# EAGLE design Pletacka_board (EAGLE 9.6.0)

## Sheet 1 of 3: ESP32 + UI
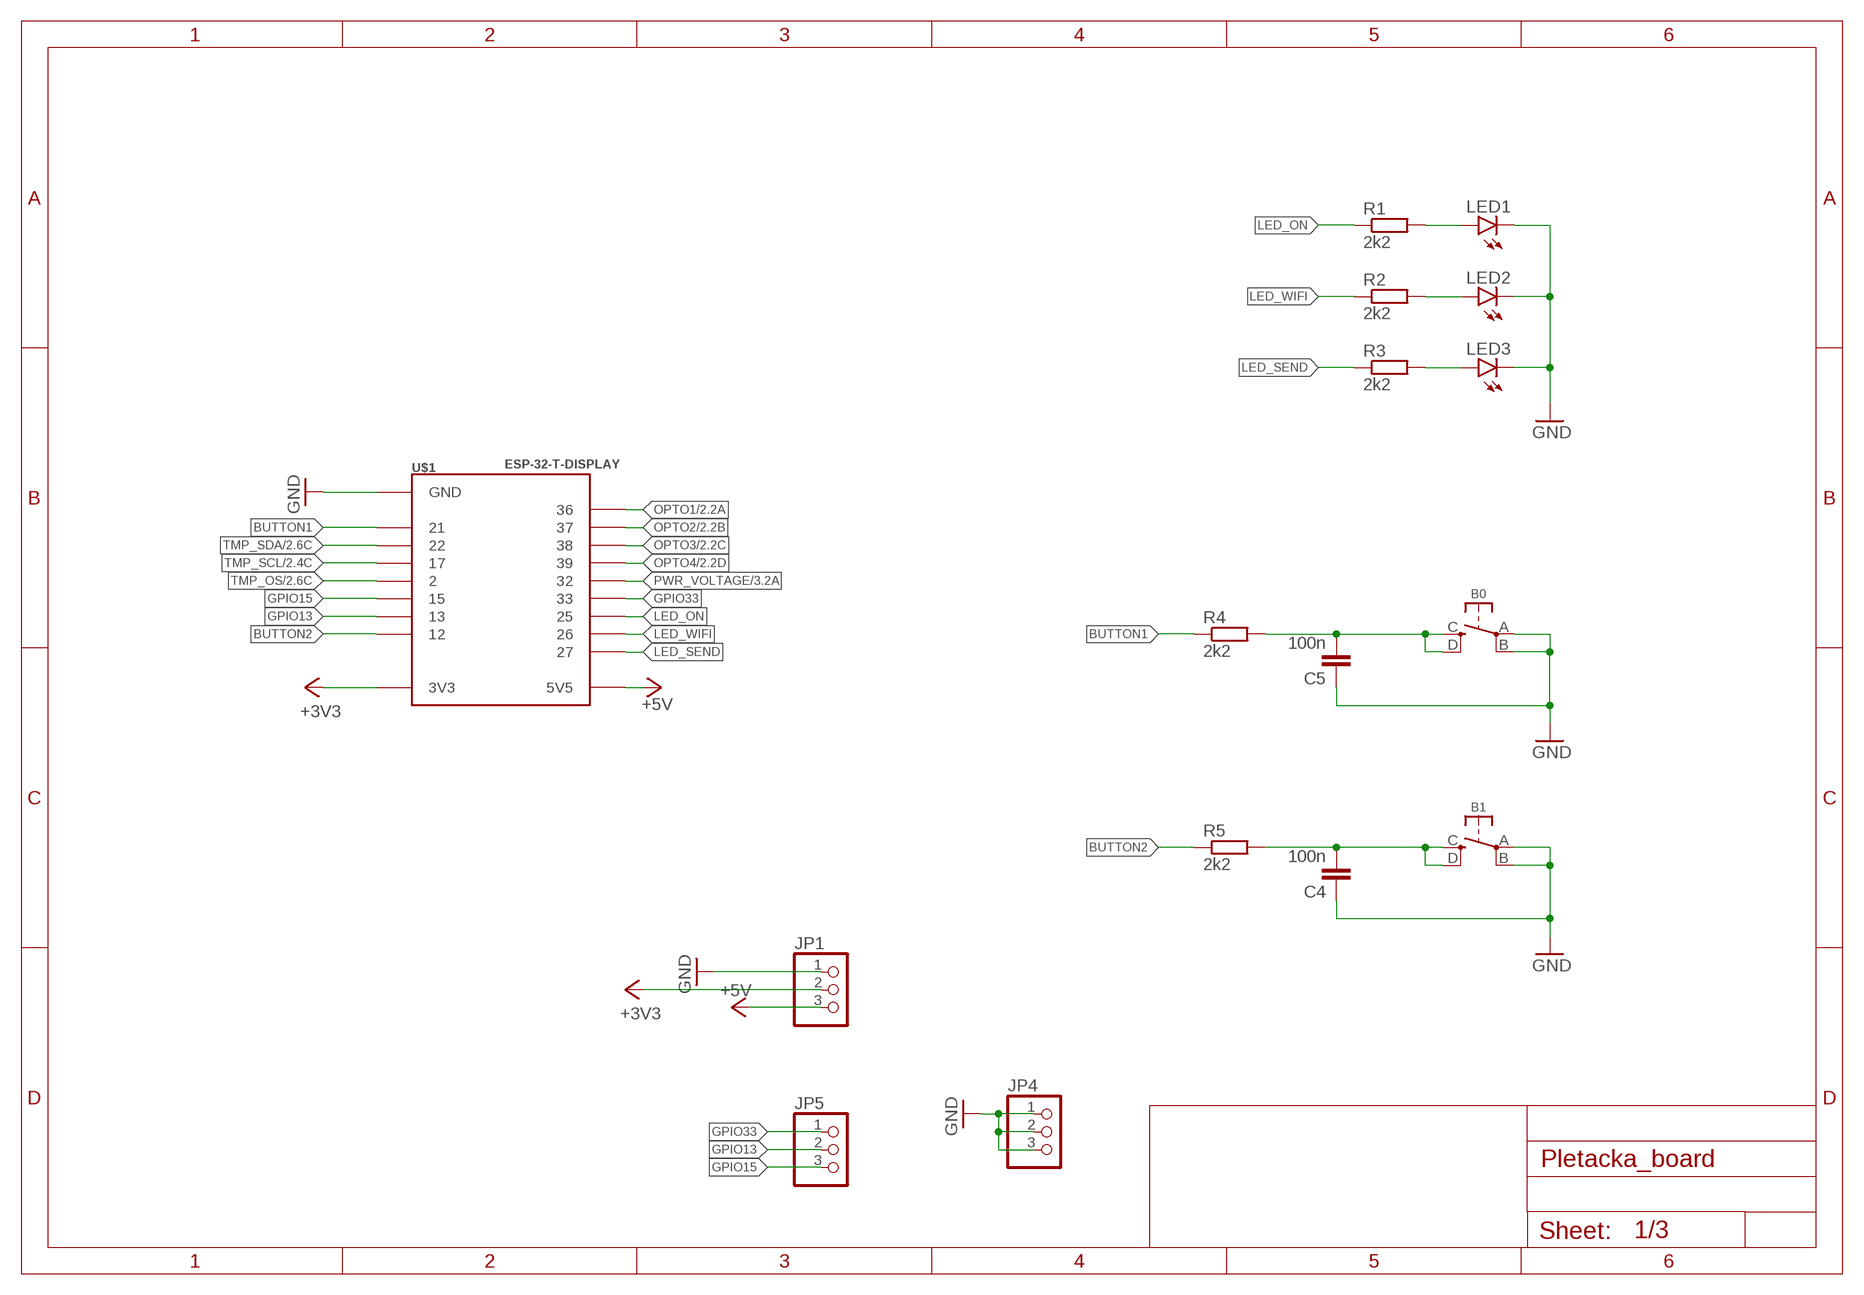
[diagram p0: schematic, sheet 1]

### Parts
B0  ENTER  10-XX_SMD  [TS-1187A]
B1  B1  10-XX_SMD  [TS-1187A]
C4  100n  C-EUC0603  [C0603]
C5  100n  C-EUC0603  [C0603]
JP1  PINHD-1X3  [1X03]
JP4  PINHD-1X3  [1X03]
JP5  PINHD-1X3  [1X03]
LED1  LEDCHIPLED_0603  [CHIPLED_0603]
LED2  LEDCHIPLED_0603  [CHIPLED_0603]
LED3  LEDCHIPLED_0603  [CHIPLED_0603]
R1  2k2  R-EU_R0603  [R0603]
R2  2k2  R-EU_R0603  [R0603]
R3  2k2  R-EU_R0603  [R0603]
R4  2k2  R-EU_R0603  [R0603]
R5  2k2  R-EU_R0603  [R0603]
U$1  ESP-32-T-DISPLAY  [ESP32-T-DISPLAY]

### Nets
+3V3: JP1.2 U$1.3V3 U$1.3V3-2(3V3) ; also sheet 2
+5V: JP1.3 U$1.5V(5V5) ; also sheet 3
BUTTON1: R4.1 U$1.21
BUTTON2: R5.1 U$1.12
GND: B0.A(P) B0.B(P1) B1.A(P) B1.B(P1) C4.1 C5.1 JP1.1 JP4.1 JP4.2 JP4.3 LED1.C LED2.C LED3.C U$1.G-1(GND) U$1.G-2(GND) U$1.G-3(GND) U$1.G-4(GND) U$1.G-5(GND) ; also sheet 2,3
GPIO13: JP5.2 U$1.13
GPIO15: JP5.3 U$1.15
GPIO33: JP5.1 U$1.33
LED_ON: R1.1 U$1.25
LED_SEND: R3.1 U$1.27
LED_WIFI: R2.1 U$1.26
N$1: LED1.A R1.2
N$2: LED2.A R2.2
N$8: B0.C(S) B0.D(S1) C5.2 R4.2
N$10: B1.C(S) B1.D(S1) C4.2 R5.2
N$12: LED3.A R3.2
OPTO1: U$1.36 ; also sheet 2
OPTO2: U$1.37 ; also sheet 2
OPTO3: U$1.38 ; also sheet 2
OPTO4: U$1.39 ; also sheet 2
PWR_VOLTAGE: U$1.32 ; also sheet 3
TMP_OS: U$1.2 ; also sheet 2
TMP_SCL: U$1.17 ; also sheet 2
TMP_SDA: U$1.22 ; also sheet 2

## Sheet 2 of 3: Sensors
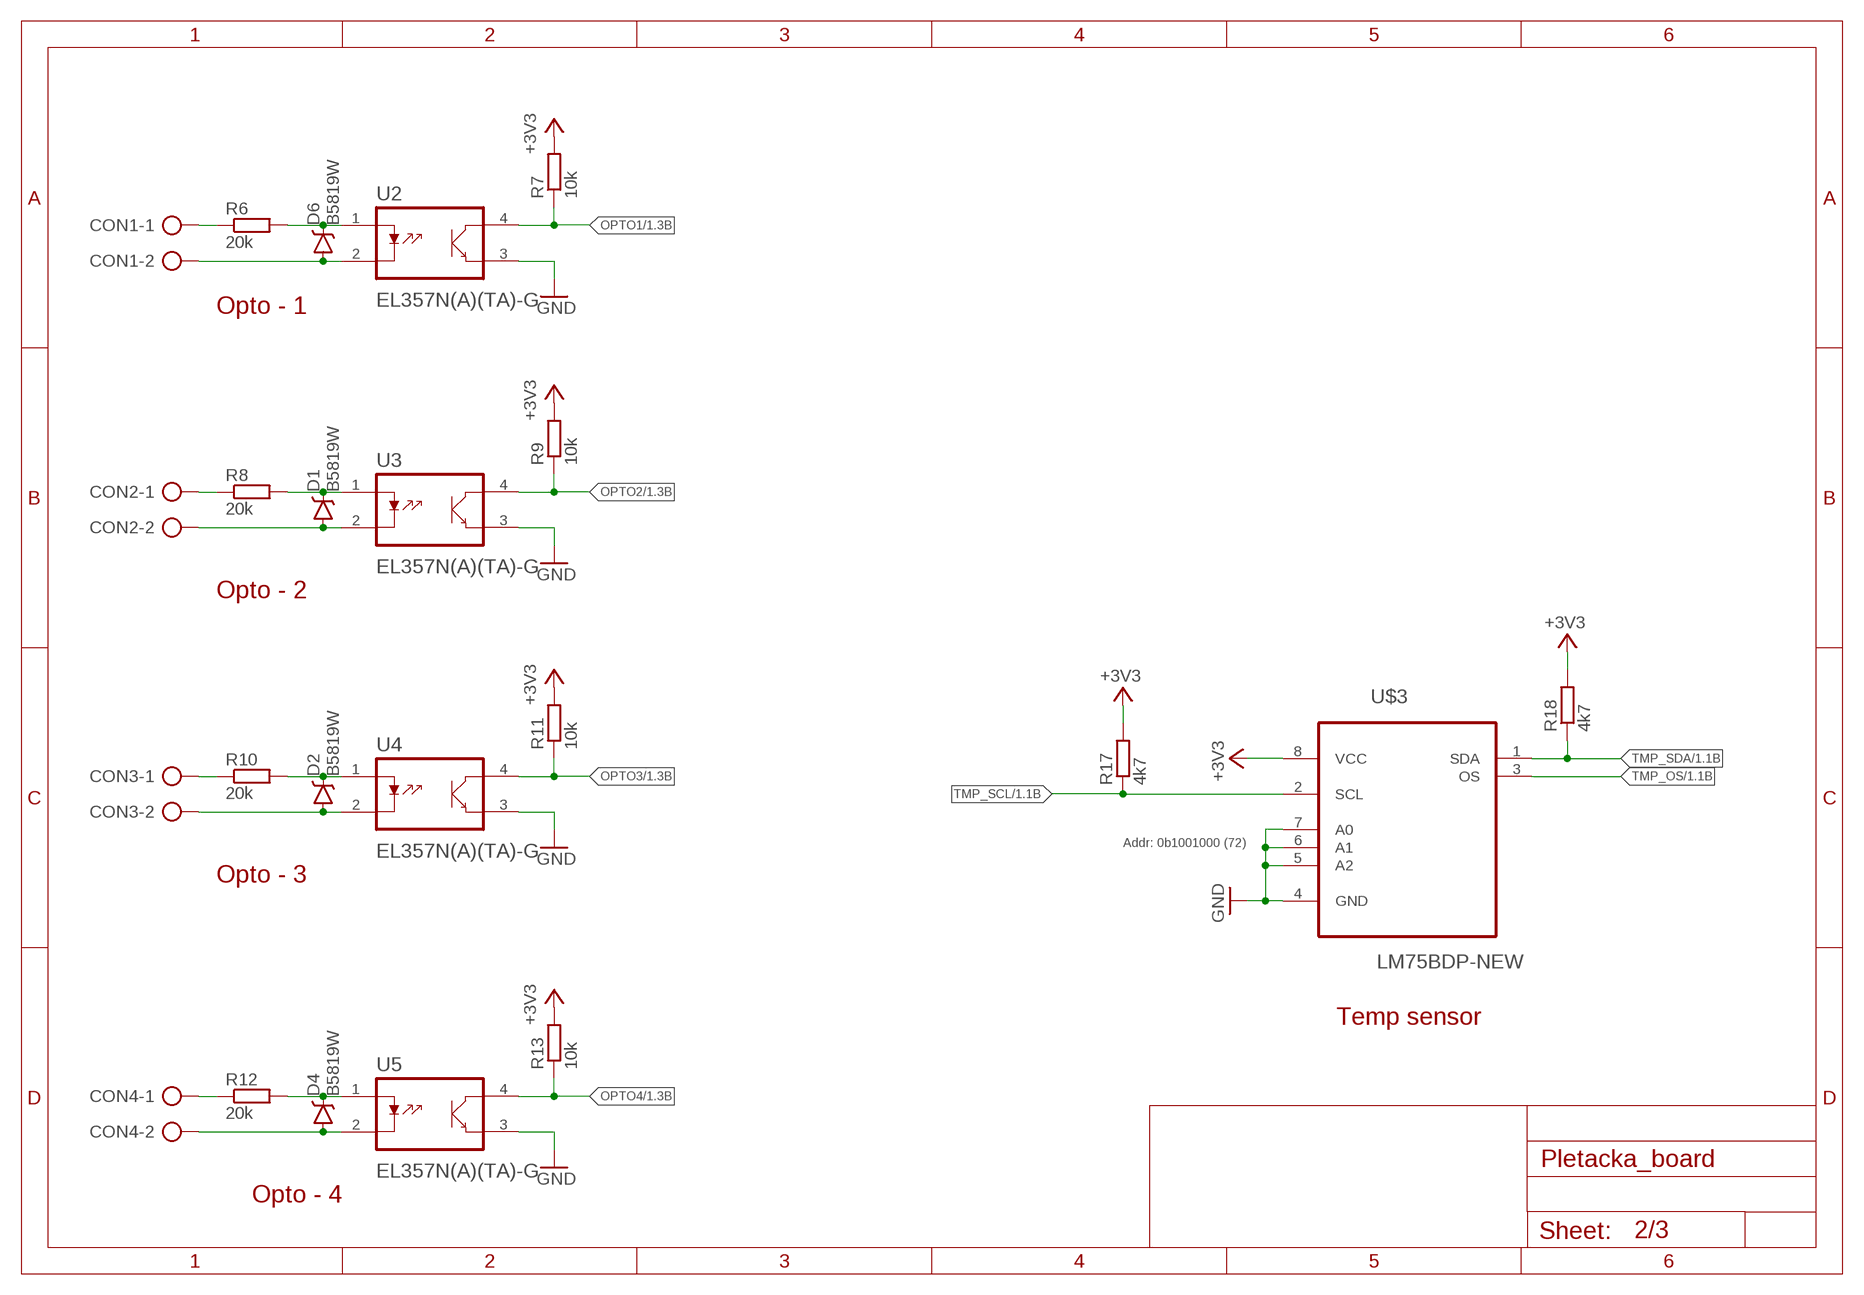
[diagram p1: schematic, sheet 2]

### Parts
CON1  AK500/2  [AK500/2]
CON2  AK500/2  [AK500/2]
CON3  AK500/2  [AK500/2]
CON4  AK500/2  [AK500/2]
D1  B5819W  [SOD-123]
D2  B5819W  [SOD-123]
D4  B5819W  [SOD-123]
D6  B5819W  [SOD-123]
R6  20k  R-EU_R0603  [R0603]
R7  10k  R-EU_R0603  [R0603]
R8  20k  R-EU_R0603  [R0603]
R9  10k  R-EU_R0603  [R0603]
R10  20k  R-EU_R0603  [R0603]
R11  10k  R-EU_R0603  [R0603]
R12  20k  R-EU_R0603  [R0603]
R13  10k  R-EU_R0603  [R0603]
R17  4k7  R-EU_R0603  [R0603]
R18  4k7  R-EU_R0603  [R0603]
U2  EL357N(A)(TA)-G  [SOP254P700X200-4N]
U3  EL357N(A)(TA)-G  [SOP254P700X200-4N]
U4  EL357N(A)(TA)-G  [SOP254P700X200-4N]
U5  EL357N(A)(TA)-G  [SOP254P700X200-4N]
U$3  LM75BDP-NEW  [SOT505-1]

### Nets
+3V3: R7.2 R9.2 R11.2 R13.2 R17.2 R18.2 U$3.8(VCC) ; also sheet 1
GND: U2.3(E) U3.3(E) U4.3(E) U5.3(E) U$3.4(GND) U$3.5(A2) U$3.6(A1) U$3.7(A0) ; also sheet 1,3
N$6: CON1.1 R6.1
N$7: CON1.2 D6.A U2.2(K)
N$9: D6.C R6.2 U2.1(A)
N$13: CON2.1 R8.1
N$14: CON2.2 D1.A U3.2(K)
N$15: D1.C R8.2 U3.1(A)
N$16: CON3.1 R10.1
N$17: CON3.2 D2.A U4.2(K)
N$18: D2.C R10.2 U4.1(A)
N$19: CON4.1 R12.1
N$20: CON4.2 D4.A U5.2(K)
N$21: D4.C R12.2 U5.1(A)
OPTO1: R7.1 U2.4(C) ; also sheet 1
OPTO2: R9.1 U3.4(C) ; also sheet 1
OPTO3: R11.1 U4.4(C) ; also sheet 1
OPTO4: R13.1 U5.4(C) ; also sheet 1
TMP_OS: U$3.3(OS) ; also sheet 1
TMP_SCL: R17.1 U$3.2(SCL) ; also sheet 1
TMP_SDA: R18.1 U$3.1(SDA) ; also sheet 1

### Notes on the sheet
- Opto - 1
- Opto - 2
- Addr: 0b1001000 (72)
- Opto - 3
- Temp sensor
- Opto - 4

## Sheet 3 of 3: Power
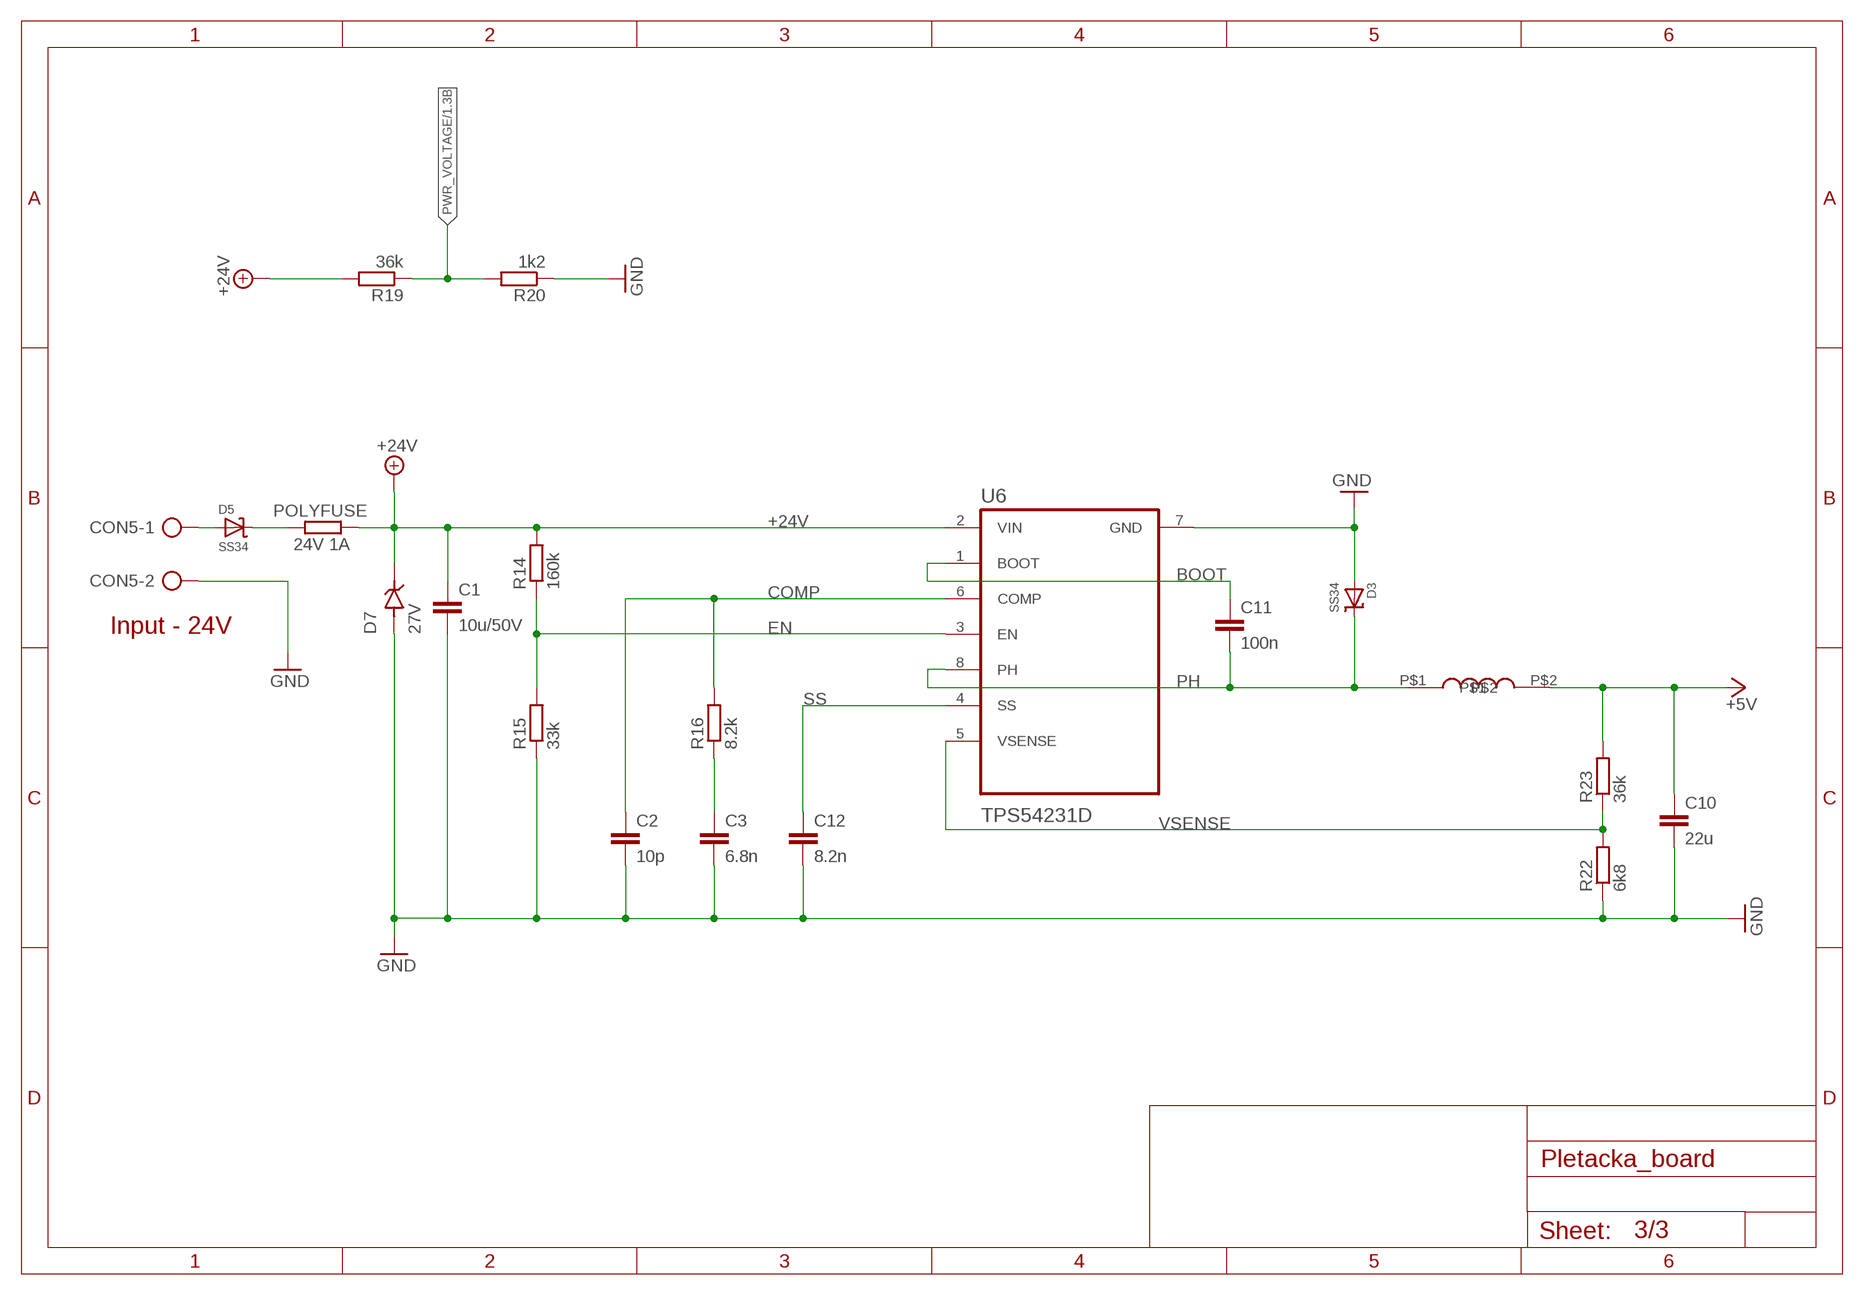
[diagram p2: schematic, sheet 3]

### Parts
C1  10u/50V  C-EUC1206  [C1206]
C2  10p  C-EUC0603  [C0603]
C3  6.8n  C-EUC0603  [C0603]
C10  22u  C-EUC0805  [C0805]
C11  100n  C-EUC0603  [C0603]
C12  8.2n  C-EUC0603  [C0603]
CON5  AK500/2  [AK500/2]
D3  SS34  SHOTTKY-SMA  [SMA]
D5  SS34  SHOTTKY-SMA  [SMA]
D7  27V  1SMB5935BT3G  [DIOM5436X247N]
POLYFUSE  24V 1A  R-EU_R1206  [R1206]
R14  160k  R-EU_R0603  [R0603]
R15  33k  R-EU_R0603  [R0603]
R16  8.2k  R-EU_R0603  [R0603]
R19  36k  R-EU_R0603  [R0603]
R20  1k2  R-EU_R0603  [R0603]
R22  6k8  R-EU_R0603  [R0603]
R23  36k  R-EU_R0603  [R0603]
U6  TPS54231D  [SOIC127P599X175-8N]
U$2  SWRB1204S  [SWRB1204S]

### Nets
+5V: C10.1 R23.2 U$2.P$2 ; also sheet 1
+24V: C1.1 D7.C(K) POLYFUSE.1 R14.2 R19.2 U6.2(VIN)
BOOT: C11.1 U6.1(BOOT)
COMP: C2.1 R16.2 U6.6(COMP)
EN: R14.1 R15.2 U6.3(EN)
GND: C1.2 C2.2 C3.2 C10.2 C12.2 CON5.2 D3.A D7.A R15.1 R20.1 R22.1 U6.7(GND) ; also sheet 1,2
N$3: CON5.1 D5.A
N$4: D5.C POLYFUSE.2
N$25: C3.1 R16.1
PH: C11.2 D3.C U6.8(PH) U$2.P$1
PWR_VOLTAGE: R19.1 R20.2 ; also sheet 1
SS: C12.1 U6.4(SS)
VSENSE: R22.2 R23.1 U6.5(VSENSE)

### Notes on the sheet
- Input - 24V

## Library data of the parts
B0 B1 = switch-omron:10-XX: OMRON SWITCH; LCSC_ID: C318888
C1 = rcl_upravena:C-EU: CAPACITOR, European symbol; LCSC_ID: C13585
C2 = rcl_upravena:C-EU: CAPACITOR, European symbol; LCSC_ID: C1634
C3 = rcl_upravena:C-EU: CAPACITOR, European symbol; LCSC_ID: C1631
C4 C5 C11 = rcl_upravena:C-EU: CAPACITOR, European symbol; LCSC_ID: C14663
C10 = rcl_upravena:C-EU: CAPACITOR, European symbol; LCSC_ID: C45783
C12 = rcl_upravena:C-EU: CAPACITOR, European symbol; LCSC_ID: C27920
CON1-CON5 = #Svorkovnice:AK500/2: CONNECTOR
D1 D2 D4 D6 = B5819W:B5819W: Diodo Schottky 40V 1A Basic part Buy Part <https://snapeda.com/parts/B5819W/Taiwan%20Semiconductor/view-part/?ref=eda>; AVAILABILITY: Warning; DESCRIPTION: B5819W; LCSC_ID: C8598; MF: Taiwan Semiconductor; MP: B5819W; PACKAGE: SOD-123 Taiwan Semiconductor; PRICE: None
D3 D5 = diode:SHOTTKY; LCSC_ID: C8678
D7 = 1SMB5935BT3G:1SMB5935BT3G: Zener Diode 5.6V 3W ±5% Surface Mount SMB Buy Part <https://snapeda.com/parts/1SMB5935BT3G/ON%20Semiconductor/view-part/?ref=eda>; ARROW_ELECTRONICS-PURCHASE-URL: https://snapeda.com/shop?store=Arrow+Electronics&id=285964; AVAILABILITY: Good; DESCRIPTION: Zener Diode 27V 550mW ±5% Surface Mount SMB; DIGIKEY-PURCHASE-URL: https://snapeda.com/shop?store=DigiKey&id=285964; LCSC_ID: C49827; MF: ON Semiconductor; MOUSER-PURCHASE-URL: https://snapeda.com/shop?store=Mouser&id=285964; MP: 1SMB5935BT3G; PACKAGE: DO-214 ON Semiconductor; PRICE: None
JP1 JP4 JP5 = pinhead:PINHD-1X3: PIN HEADER
LED1-LED3 = led:LED: LED OSRAM: - CHIPLED LG R971, LG N971, LY N971, LG Q971, LY Q971, LO R971, LY R971 LH N974, LH R974 LS Q976, LO Q976, LY Q976 LO Q996 - Hyper CHIPLED LW Q18S LB Q993, LB Q99A, LB R99A - SideLED LS A670, LO A670, LY A670, LG A670, LP A670 LB A673, LV A673, LT A673, LW A673 LH A674 LY A675 LS A676, LA A676, LO A676, LY A676, LW A676 LS A679, LY A679, LG A679 - Hyper Micro SIDELED® LS Y876, LA Y876, LO Y876, LY Y876 LT Y87S - SmartLED LW L88C, LW L88S LB L89C, LB L89S, LG L890 LS L89K, LO L89K, LY L89K LS L896, LA L896, LO L896, LY L896 - TOPLED LS T670, LO T670, LY T670, LG T670, LP T670 LSG T670, LSP T670, LSY T670, LOP T670, LYG T670 LG T671, LOG T671, LSG T671 LB T673, LV T673, LT T673, LW T673 LH T674 LS T676, LA T676, LO T676, LY T676, LB T676, LH T676, LSB T676, LW T676 LB T67C, LV T67C, LT T67C, LS T67K, LO T67K, LY T67K, LW E67C LS E67B, LA E67B, LO E67B, LY E67B, LB E67C, LV E67C, LT E67C LW T67C LS T679, LY T679, LG T679 LS T770, LO T770, LY T770, LG T770, LP T770 LB T773, LV T773, LT T773, LW T773 LH T774 LS E675, LA E675, LY E675, LS T675 LS T776, LA T776, LO T776, LY T776, LB T776 LHGB T686 LT T68C, LB T68C - Hyper Mini TOPLED® LB M676 - Mini TOPLED Santana® LG M470 LS M47K, LO M47K, LY M47K Source: http://www.osram.convergy.de LUXEON: - LUMILED® LXK2-PW12-R00, LXK2-PW12-S00, LXK2-PW14-U00, LXK2-PW14-V00 LXK2-PM12-R00, LXK2-PM12-S00, LXK2-PM14-U00 LXK2-PE12-Q00, LXK2-PE12-R00, LXK2-PE12-S00, LXK2-PE14-T00, LXK2-PE14-U00 LXK2-PB12-K00, LXK2-PB12-L00, LXK2-PB12-M00, LXK2-PB14-N00, LXK2-PB14-P00, LXK2-PB14-Q00 LXK2-PR12-L00, LXK2-PR12-M00, LXK2-PR14-Q00, LXK2-PR14-R00 LXK2-PD12-Q00, LXK2-PD12-R00, LXK2-PD12-S00 LXK2-PH12-R00, LXK2-PH12-S00 LXK2-PL12-P00, LXK2-PL12-Q00, LXK2-PL12-R00 Source: www.luxeon.com KINGBRIGHT: KA-3528ASYC Source: www.kingbright.com; LCSC_ID: C2286
POLYFUSE = rcl_upravena:R-EU_: RESISTOR, European symbol; LCSC_ID: C70076; MFR_ID: nSMD050-24V
R1-R5 = rcl_upravena:R-EU_: RESISTOR, European symbol; LCSC_ID: C4190
R6 R8 R10 R12 = rcl_upravena:R-EU_: RESISTOR, European symbol; LCSC_ID: C4184
R7 R9 R11 R13 = rcl_upravena:R-EU_: RESISTOR, European symbol; LCSC_ID: C25804
R14 = rcl_upravena:R-EU_: RESISTOR, European symbol; LCSC_ID: C22813
R15 = rcl_upravena:R-EU_: RESISTOR, European symbol; LCSC_ID: C4216
R16 = rcl_upravena:R-EU_: RESISTOR, European symbol; LCSC_ID: C25981
R17 R18 = rcl_upravena:R-EU_: RESISTOR, European symbol; LCSC_ID: C23162
R19 R23 = rcl_upravena:R-EU_: RESISTOR, European symbol; LCSC_ID: C23147
R20 = rcl_upravena:R-EU_: RESISTOR, European symbol; LCSC_ID: C22765
R22 = rcl_upravena:R-EU_: RESISTOR, European symbol; LCSC_ID: C23212
U2-U5 = EL357N_A__TA_-G:EL357N(A)(TA)-G: Optocoupler [Everlight Electronics] EL357N(A)(TA)-G Optocoupler; AVAILABILITY: Unavailable; DESCRIPTION: Optoisolator Transistor Output 3750Vrms 1 Channel 4-SOP (2.54mm); LCSC_ID: C6649; MF: Everlight Electronics; MP: EL357N(A)(TA)-G; PACKAGE: SOP-4 Everlight; PRICE: None
U6 = TPS54231D:TPS54231D: Buy Part <https://snapeda.com/parts/TPS54231D/Texas%20Instruments/view-part/?ref=eda>; AVAILABILITY: Good; DESCRIPTION: 3.5 to 28V Input, 2A, 570kHz Step-Down Converter with Eco-mode&trade, 8-SOIC -40 to 150; DIGIKEY-PURCHASE-URL: https://snapeda.com/shop?store=DigiKey&id=456068; LCSC_ID: C28023; MF: Texas Instruments; MOUSER-PURCHASE-URL: https://snapeda.com/shop?store=Mouser&id=456068; MP: TPS54231D; PACKAGE: SOIC-8 Texas Instruments; PRICE: None; TEXAS_INSTRUMENTS-PURCHASE-URL: https://snapeda.com/shop?store=Texas+Instruments&id=456068
U$1 = ESP32-T-Display:ESP-32-T-DISPLAY
U$2 = SWRB1204S-680MT:SWRB1204S; LCSC_ID: C169399
U$3 = LM75BDP:LM75BDP-NEW; LCSC_ID: C33099

## Board
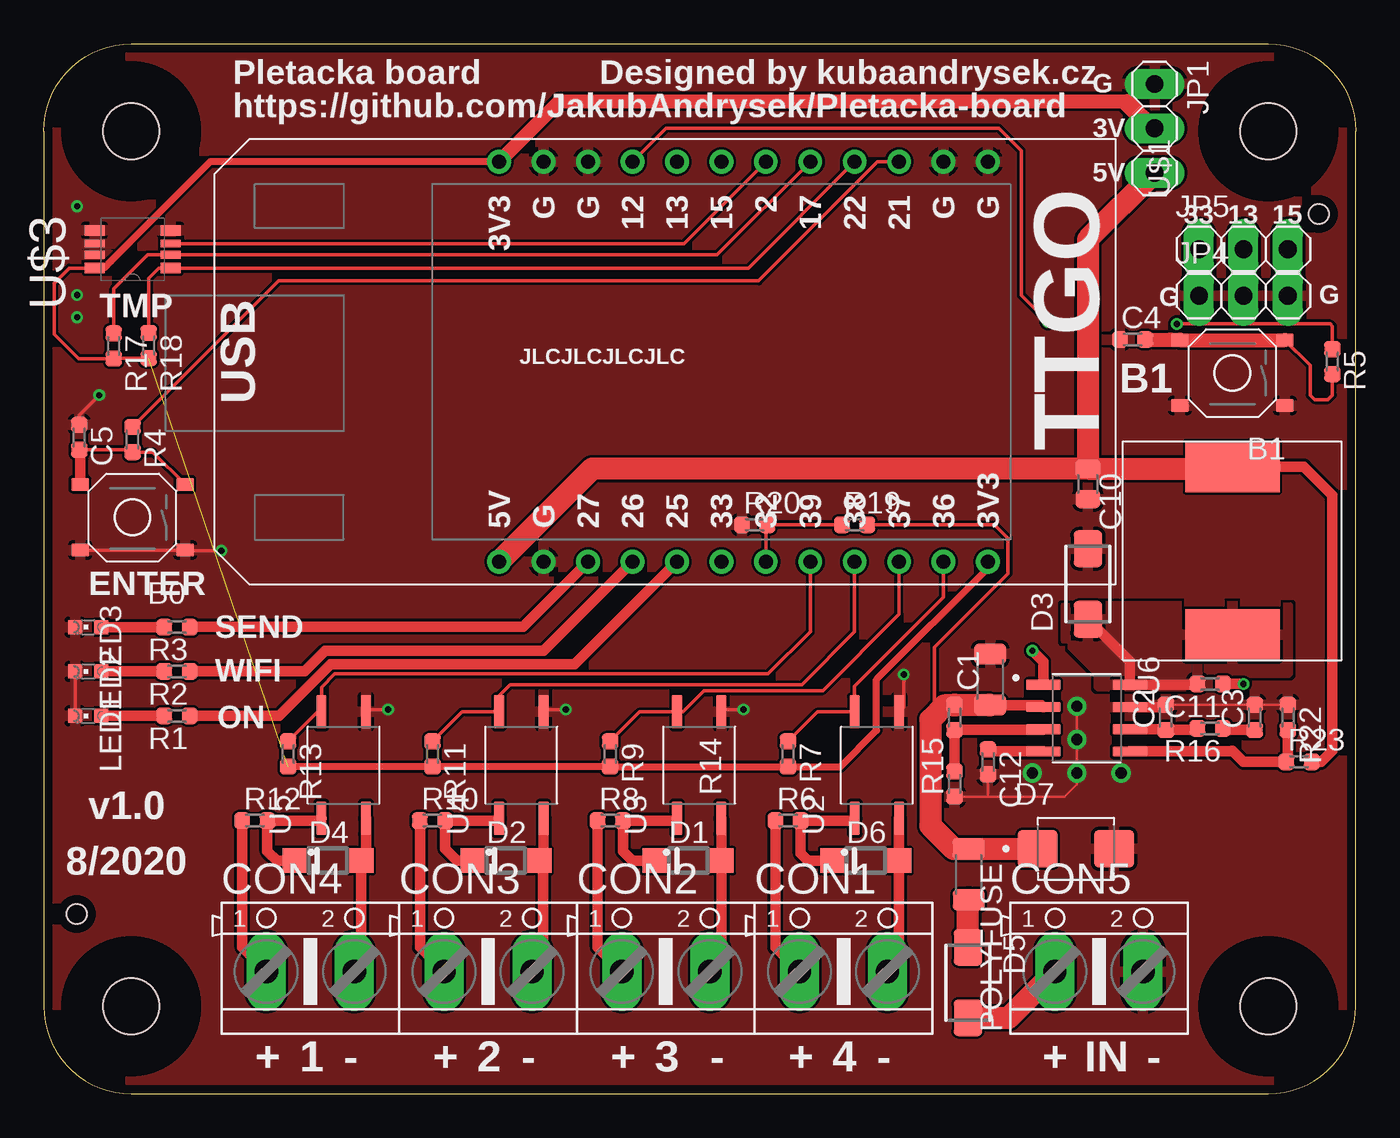
[diagram p3: board, top side]
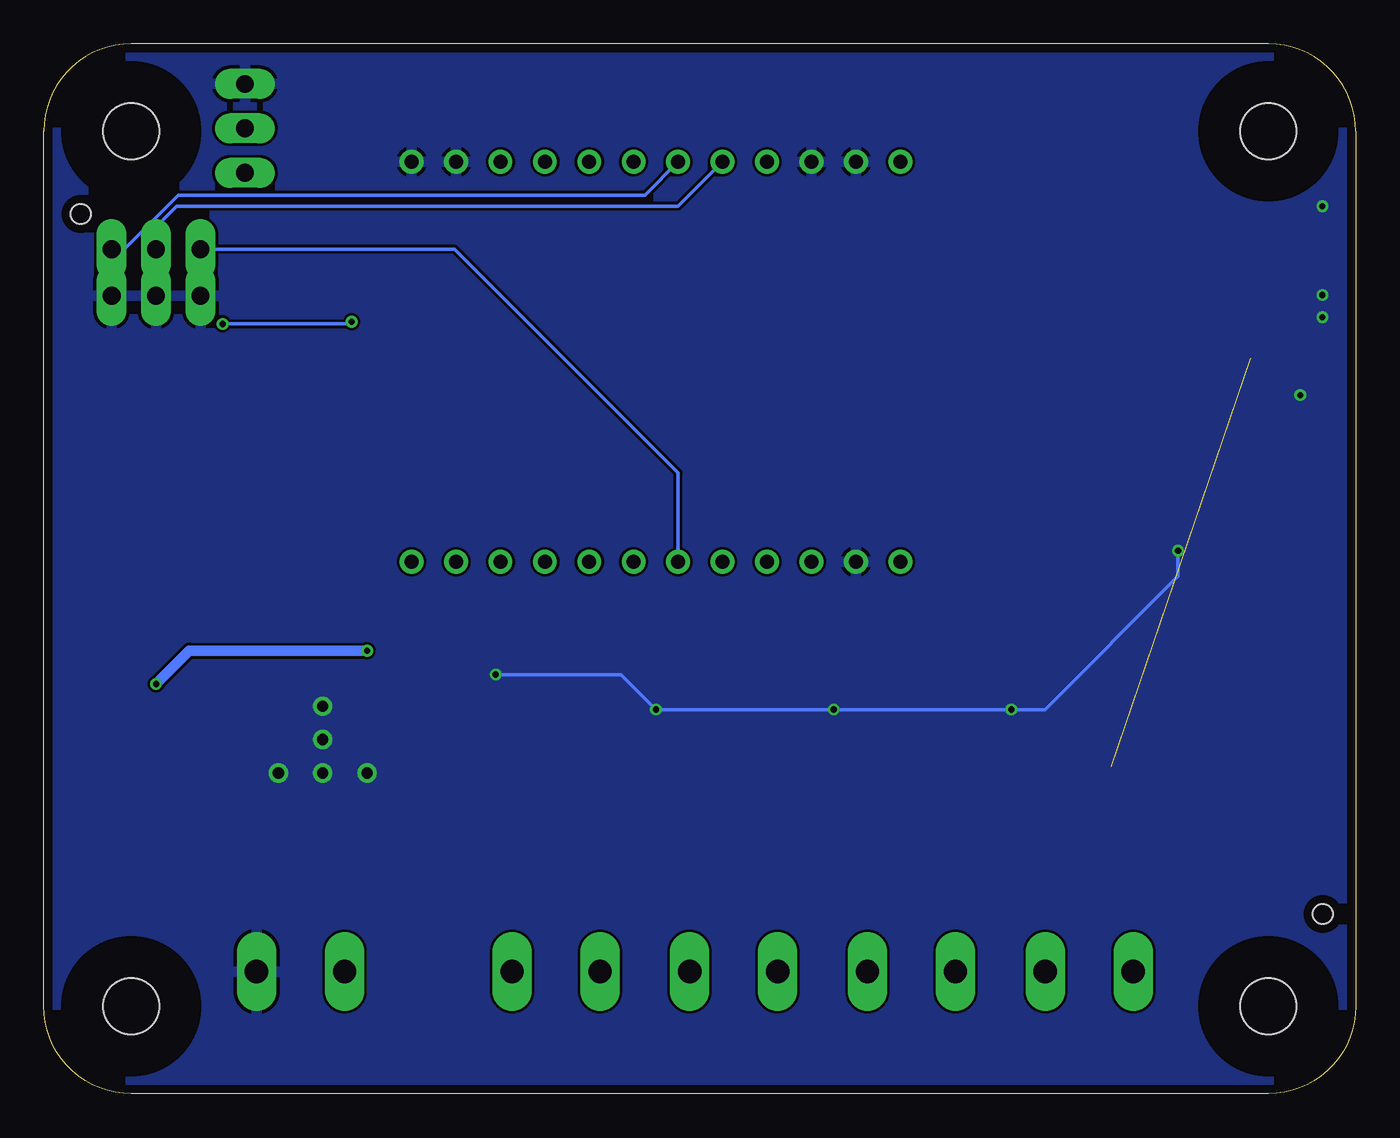
[diagram p4: board, bottom side, seen from below]

Size 75 x 60 mm. Coordinates in mm from the lower left corner, seen from the top.
Outline: 0,55 0,5 arc90 5,0 70,0 arc90 75,5 75,55 arc90 70,60 5,60 arc90 0,55
Copper layers (1*16): Top 0.035mm / dielectric 1.5mm / Bottom 0.035mm
Design rules "roboticsbrno": minimum track width 0.15mm, minimum drill 0.3mm, track to track 0.15mm, track to pad 0.15mm, pad to pad 0.15mm, via to via 0.15mm, smd to smd 0.15mm, copper to edge 0.5mm, drill to drill 0.5mm, minimum pad ring 0.16mm, minimum via ring 0.16mm, stop-mask expansion 0.1mm, vias tented up to drill 0.4mm, thermal gap 0.2mm
Holes 3.2 mm at 5,5 70,5 70,55 5,55
Holes 1.15 mm at 72.89,50.27 1.89,10.27
tRestrict: area 1,1 to 9,9; area 66,1 to 74,9; area 66,51 to 74,59; area 1,51 to 9,59
bRestrict: area 1,51 to 9,59; area 66,51 to 74,59; area 1,1 to 9,9; area 66,1 to 74,9; area 71.9,49.3 to 73.9,51.3; area 0.9,9.3 to 2.9,11.3

### Footprints (pad centres in the part's own frame; a part is rotated, then mirrored left to right if it is on the bottom)
TS-1187A = smd 1 x 0.75: A -3,1.875; B 3,1.875; C -3,-1.875; D 3,-1.875
C1206 = smd 1.2 x 1.82: 1 -1.46,0; 2 1.46,0
C0603 = smd 0.89 x 0.93: 1 -0.72,0; 2 0.72,0
C0805 = smd 1.03 x 1.42: 1 -0.87,0; 2 0.87,0
AK500/2 = drill 1.321 long: 1 -2.515,0; 2 2.515,0
SOD-123 = smd 1.4 x 1.4: A 1.9,0; C -1.9,0
SMA = smd 2.08 x 1.62: A 2.015,0; C -2.015,0
DIOM5436X247N = smd 2.25 x 2.12: A 2.185,0; C -2.185,0
1X03 = drill 1.016 long: 1 -2.54,0; 2 0,0; 3 2.54,0
CHIPLED_0603 = smd 0.8 x 0.8: A -0.75,0; C 0.75,0
R1206 = smd 1.2 x 1.82: 1 -1.46,0; 2 1.46,0
R0603 = smd 0.89 x 0.93: 1 -0.72,0; 2 0.72,0
SOP254P700X200-4N = smd 1.93 x 0.59: 1 -3.04,1.27; 2 -3.04,-1.27; 3 3.04,-1.27; 4 3.04,1.27
SOIC127P599X175-8N = smd 0.6 x 1.97: 1 -1.905,-2.47; 2 -0.635,-2.47; 3 0.635,-2.47; 4 1.905,-2.47; 5 1.905,2.47; 6 0.635,2.47; 7 -0.635,2.47; 8 -1.905,2.47
ESP32-T-DISPLAY = drill 0.8: 2 -11.43,16.51; 3V3 -11.43,1.27; 3V3-2 11.43,29.21; 5V 11.43,1.27; 12 -11.43,8.89; 13 -11.43,11.43; 15 -11.43,13.97; 17 -11.43,19.05; 21 -11.43,24.13; 22 -11.43,21.59; 25 11.43,11.43; 26 11.43,8.89; 27 11.43,6.35; 32 11.43,16.51; 33 11.43,13.97; 36 11.43,26.67; 37 11.43,24.13; 38 11.43,21.59; 39 11.43,19.05; G-1 -11.43,29.21; G-2 -11.43,26.67; G-3 -11.43,6.35; G-4 -11.43,3.81; G-5 11.43,3.81
SWRB1204S = smd 2.9 x 5.4: P$1 -4.8,0; P$2 4.8,0
SOT505-1 = smd 0.6 x 1.15: 1 -1.077,-2.175; 4 1.077,-2.175; 5 1.077,2.175; 8 -1.077,2.175 | smd 0.45 x 1.15: 2 -0.325,-2.175; 3 0.325,-2.175; 6 0.325,2.175; 7 -0.325,2.175

### Placement (x,y rotation side)
B0  5.08,32.94 180 top
B1  67.94,41.2 180 top
C1  54.1,23.67 90 top
C2  64.14,21.51 90 top
C3  69.22,21.51 90 top
C4  62.23,43.1 0 top
C5  2.03,37.51 270 top
C10  59.69,34.84 270 top
C11  66.67,23.41 180 top
C12  53.98,18.97 270 top
CON1  45.72,6.99 0 top
CON2  35.56,6.99 0 top
CON3  25.4,6.99 0 top
CON4  15.24,6.99 0 top
CON5  60.33,6.99 0 top
D1  36.83,13.32 0 top
D2  26.42,13.32 0 top
D3  59.69,29.13 90 top
D4  16.26,13.32 0 top
D5  52.83,6.35 270 top
D6  46.99,13.32 0 top
D7  59,14 0 top
JP1  63.5,55.16 270 top
JP4  68.58,45.59 0 top
JP5  68.58,48.26 0 top
LED1  2.54,21.59 180 top
LED2  2.54,24.13 180 top
LED3  2.54,26.67 180 top
POLYFUSE  52.88,12.54 270 top
R1  7.62,21.59 180 top
R2  7.62,24.13 180 top
R3  7.62,26.67 180 top
R4  5.08,37.38 270 top
R5  73.66,41.83 270 top
R6  42.55,15.61 0 top
R7  42.55,19.41 270 top
R8  32.38,15.61 0 top
R9  32.38,19.41 270 top
R10  22.23,15.61 0 top
R11  22.23,19.41 270 top
R12  12.06,15.61 0 top
R13  13.97,19.41 270 top
R14  52.07,21.51 90 top
R15  52.07,17.7 90 top
R16  66.67,20.88 180 top
R17  4,42.73 270 top
R18  6,42.75 270 top
R19  46.35,32.51 0 top
R20  40.64,32.51 0 top
R22  71.12,21.51 270 top
R23  71.75,18.97 0 top
U2  47.62,18.78 90 top
U3  37.47,18.78 90 top
U4  27.3,18.78 90 top
U5  17.14,18.78 90 top
U6  59.61,21.46 270 top
U$1  24.77,41.83 270 top
U$2  67.94,31.04 90 top
U$3  5.08,48.26 90 top

### Tracks (layer width: path | path; a pad name or v marks a point on that pad's centre or on a via)
+3V3  (1 unrouted)
  Top 0.2: R18.2 4.02,42.03 R17.2 1.99,42.01 0.6,43.4 0.6,46.32 1.46,47.18 2.54,47.18 U$3.8
  Top 0.406: R13.2 R11.2 R9.2 R7.2 45.55,18.7 47.61,20.76 47.61,23.67 53.98,30.04 U$1.3V3-2 | U$1.3V3 9.53,53.26 3.83,47.57 3.83,47.56 3.45,47.18 2.54,47.18
  Top 0.61: JP1.2 63.1,55.16 61.55,56.72 29.5,56.72
  Top 0.813: U$1.3V3 29.5,56.72 61.95,56.72 JP1.2
+5V
  Top 0.61: R23.2 73.03,18.97 73.66,19.61 73.66,34.21 72.03,35.84 U$2.P$2 | U$2.P$2 67.83,35.84 67,35 67.11,35 U$2.P$2
  Top 1.27: JP1.3 59.69,48.81 C10.1 | C10.1 31.35,35.72 U$1.5V | C10.1 67.83,35.72 U$2.P$2
+24V
  Top 0.2: R19.2 54.36,32.51 55.12,31.75 55.12,29.72 50.93,25.53 50.93,21.64 50.67,21.38
  Top 0.61: C1.1 57.03,22.21 U6.2
  Top 0.813: C1.1 54.08,22.19 52.11,22.19 51.48,22.19
  Top 1.27: R14.2 52.11,22.19 | R14.2 52.03,22.19 51.48,22.19 50.67,21.38 50.67,15.33 52,14 POLYFUSE.1 D7.C | R14.2 54.04,22.23 54.08,22.19
BOOT  (via drill 0.35)
  Top 0.61: v68.58,23.41 C11.1 | U6.1 57.14,24.7 v56.52,25.32
  Bottom 0.61: v68.58,23.41 66.67,25.32 v56.52,25.32
BUTTON1
  Top 0.2: R4.1 13.43,46.45 40.86,46.45 47.67,53.26 U$1.21
BUTTON2  (via drill 0.35)
  Top 0.2: U$1.12 35.56,55.16 54.61,55.16 55.88,53.9 55.88,45.64 v57.4,44.12 | R5.1 73.66,43.86 73.53,43.99 v64.77,43.99
  Bottom 0.2: v57.4,44.12 57.53,43.99 v64.77,43.99
COMP
  Top 0.61: R16.2 65.87,20.79 C2.1 64.05,20.88 64,20.83 U6.6
EN
  Top 0.61: R15.2 R14.1 57.1,20.79 U6.3
GND  (via drill 0.35, 0.65)
  Top 0.152: R15.1 53.98,16.98 | 53.98,16.98 58.34,16.98 59.05,17.7 v59.05,18.34 v59.05,20.24 v59.05,22.14 | C12.2 53.98,16.98 | 64.05,22.14 C2.2 C3.2 | C3.2 69.22,22.14 | R22.1 C3.2
  Top 0.2: LED2.C LED1.C | B0.B B0.A 8.11,31.04 v10.16,31.04 | U5.3 18.55,21.95 v19.68,21.95 | v29.84,21.95 28.71,21.95 U4.3 | v40.01,21.95 38.87,21.95 U3.3 | 49.16,22.09 | 49.16,22.09 U2.3 | B1.B 65.41,39.32 | C5.1 2.03,38.78 v3.17,39.92 | 61.51,42.76 C4.1 | v49.16,23.95 49.16,22.09
  Top 0.61: U6.7 64,22.1 C2.2
  Bottom 0.2: v10.16,31.04 10.16,29.57 17.78,21.95 v19.68,21.95 v29.84,21.95 v40.01,21.95 42.01,23.95 v49.16,23.95
  other vias: 1.91,50.72 61.59,18.34 56.52,18.34 1.91,45.64 1.91,44.37
  pour Top (rank 2): 0,60 74.93,60 74.93,0 0,0
  pour Bottom: 0,60 0,0 74.93,0 74.93,60
GPIO13
  Bottom 0.2: U$1.13 38.73,50.72 67.39,50.72 68.58,49.53 JP5.2
GPIO15
  Bottom 0.2: U$1.15 40.64,51.35 67.31,51.35 70.41,48.26 JP5.3
GPIO33
  Bottom 0.2: U$1.33 38.73,35.48 51.52,48.26 JP5.1
LED_ON
  Top 0.61: U$1.25 30.34,24.54 16.41,24.54 13.46,21.59 R1.1
LED_SEND
  Top 0.61: R3.1 8.37,26.7 27.41,26.7 U$1.27
LED_WIFI
  Top 0.61: R2.1 14.92,24.13 16.09,25.3 28.56,25.3 U$1.26
N$1
  Top 0.61: R1.2 LED1.A
N$2
  Top 0.61: R2.2 LED2.A
N$3
  Top 1.27: D5.A 55.16,4.33 CON5.1
N$4
  Top 1.27: D5.C 52.83,11.03 POLYFUSE.2
N$6
  Top 0.61: CON1.1 41.83,8.37 R6.1
N$7
  Top 0.61: CON1.2 48.9,7.64 D6.A U2.2
N$8
  Top 0.2: C5.2 4.95,36.79 R4.2 6.23,36.66 B0.C
  Top 0.61: C5.2 2.08,36.74 B0.D
N$9
  Top 0.61: U2.1 46.22,15.61 R6.2 43.27,13.74 43.69,13.32 D6.C
N$10
  Top 0.2: 64.94,43.1 B1.D | B1.C 72.39,41.62 72.39,39.92 72.64,39.67 73.41,39.67 73.66,39.92 R5.2
  Top 0.813: C4.2 64.4,43.1 64.94,43.1 | B1.D B1.C
N$12
  Top 0.61: R3.2 LED3.A
N$13
  Top 0.61: CON2.1 31.66,8.37 R8.1
N$14
  Top 0.61: U3.2 D1.A 38.73,7.64 CON2.2
N$15
  Top 0.61: U3.1 36.06,15.61 R8.2 33.1,13.87 33.66,13.32 D1.C
N$16
  Top 0.61: R10.1 21.5,8.37 CON3.1
N$17
  Top 0.61: CON3.2 28.55,7.62 28.55,13.09 D2.A 28.57,13.58 U4.2
N$18
  Top 0.61: U4.1 25.9,15.61 R10.2 22.95,14 23.62,13.32 D2.C
N$19
  Top 0.61: CON4.1 11.35,8.37 R12.1
N$20
  Top 0.61: U5.2 18.41,13.58 D4.A 18.16,7.39 CON4.2
N$21
  Top 0.61: U5.1 15.74,15.61 R12.2 12.79,13.87 13.34,13.32 D4.C
N$25
  Top 0.61: R16.1 67.48,20.79 C3.1
OPTO1
  Top 0.2: R7.1 44.23,21.82 U2.4 46.35,23.29 51.44,28.37 U$1.36
OPTO2
  Top 0.2: R9.1 34.07,21.82 U3.4 36.53,21.82 37.74,23.04 44.53,23.04 48.9,27.4 U$1.37
OPTO3
  Top 0.2: U$1.38 46.35,26.4 43.34,23.39 26.66,23.39 26.04,22.75 U4.4 23.91,21.82 R11.1
OPTO4
  Top 0.2: R13.1 15.65,21.82 U5.4 15.88,23.23 16.64,23.99 41.4,23.99 43.81,26.4 U$1.39
PH
  Top 0.61: C11.2 65.91,23.37 U6.8 62.08,24.73 D3.C
  pour Top: 58.42,27.86 71.12,27.86 71.12,24.05 66.67,24.05 66.67,23.29 60.33,23.29 60.33,24.05 58.42,25.95
PWR_VOLTAGE
  Top 0.2: R19.1 R20.2 41.27,32.43 U$1.32
SS
  Top 0.61: U6.4 54.11,19.56 C12.1
TMP_OS
  Top 0.2: U$3.3 36.6,48.59 U$1.2
TMP_SCL
  Top 0.2: R17.1 4,46 5.93,47.94 U$3.2 38.49,47.94 U$1.17
TMP_SDA
  Top 0.2: R18.1 6,46.61 6.57,47.18 U$3.1 40.28,47.18 U$1.22
VSENSE
  Top 0.61: R22.2 71.12,19.05 R23.1 68.58,18.97 67.94,19.61 67.9,19.56 U6.5

### Text on the board
tPlace: Pletacka board | Designed by kubaandrysek.cz | G | https://github.com/JakubAndrysek/Pletacka-board | 3V | 5V | 33 | 13 | 15 | G | G | TMP | JLCJLCJLCJLC | B1 | USB | ENTER | SEND | WIFI | ON | v1.0 | 8/2020 | + | 1 | - | + | 2 | - | + | 3 | - | + | 4 | - | + | IN | -